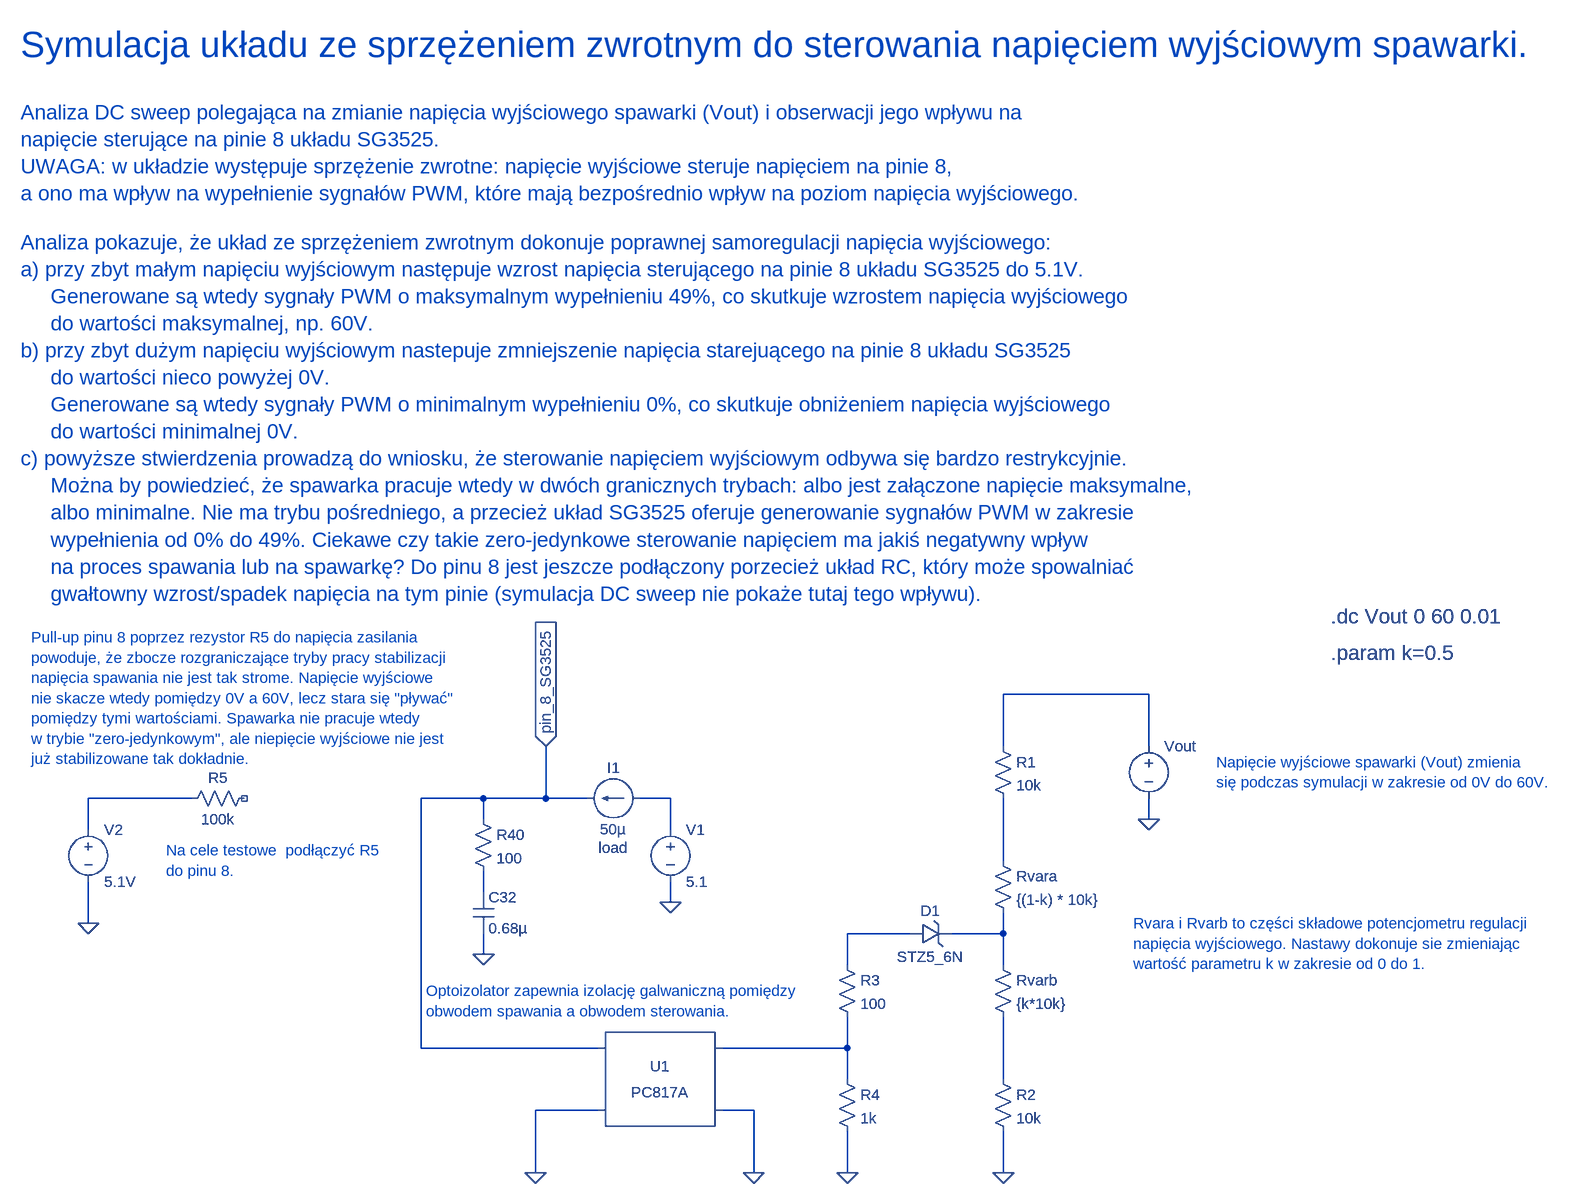
[diagram p0: schematic pin8_loopback_sim.asc]
pin8_loopback_sim.asc, the LTspice schematic file:
Version 4
SHEET 1 1872 756
WIRE 480 0 256 0
WIRE 256 80 256 0
WIRE 480 80 480 0
WIRE -992 160 -1152 160
WIRE -544 160 -640 160
WIRE -448 160 -448 80
WIRE -448 160 -544 160
WIRE -384 160 -448 160
WIRE -256 160 -304 160
WIRE -544 192 -544 160
WIRE 480 192 480 160
WIRE -1152 208 -1152 160
WIRE -256 208 -256 160
WIRE 256 256 256 160
WIRE -544 304 -544 272
WIRE -256 320 -256 288
WIRE -1152 352 -1152 288
WIRE 112 368 16 368
WIRE 256 368 256 336
WIRE 256 368 176 368
WIRE -544 400 -544 368
WIRE 16 416 16 368
WIRE 256 416 256 368
WIRE -640 544 -640 160
WIRE -368 544 -640 544
WIRE 16 544 16 496
WIRE 16 544 -176 544
WIRE 16 592 16 544
WIRE 256 592 256 496
WIRE -368 640 -464 640
WIRE -128 640 -176 640
WIRE -464 736 -464 640
WIRE -128 736 -128 640
WIRE 16 736 16 672
WIRE 256 736 256 672
FLAG 256 736 0
FLAG 480 192 0
FLAG 16 736 0
FLAG -128 736 0
FLAG -464 736 0
FLAG -256 320 0
FLAG -544 400 0
FLAG -448 80 pin_8_SG3525
IOPIN -448 80 In
FLAG -1152 352 0
SYMBOL res 240 64 R0
SYMATTR InstName R1
SYMATTR Value 10k
SYMBOL res 240 240 R0
SYMATTR InstName Rvara
SYMATTR Value {(1-k) * 10k}
SYMBOL res 240 400 R0
SYMATTR InstName Rvarb
SYMATTR Value {k*10k}
SYMBOL res 240 576 R0
SYMATTR InstName R2
SYMATTR Value 10k
SYMBOL voltage 480 64 R0
WINDOW 123 0 0 Left 0
WINDOW 39 0 0 Left 0
SYMATTR InstName Vout
SYMATTR Value ""
SYMBOL res 0 576 R0
SYMATTR InstName R4
SYMATTR Value 1k
SYMBOL res 0 400 R0
SYMATTR InstName R3
SYMATTR Value 100
SYMBOL zener 112 384 R270
WINDOW 0 36 32 VTop 2
WINDOW 3 -4 32 VBottom 2
SYMATTR InstName D1
SYMATTR Value STZ5_6N
SYMBOL Optos\\PC817A -272 592 M0
SYMATTR InstName U1
SYMBOL voltage -256 192 R0
WINDOW 123 0 0 Left 0
WINDOW 39 0 0 Left 0
SYMATTR InstName V1
SYMATTR Value 5.1
SYMBOL current -304 160 R90
WINDOW 0 -32 40 VBottom 2
WINDOW 3 32 40 VTop 2
WINDOW 123 0 0 Left 0
WINDOW 39 60 40 VTop 2
SYMATTR InstName I1
SYMATTR Value 50µ
SYMATTR SpiceLine load
SYMBOL res -560 176 R0
SYMATTR InstName R40
SYMATTR Value 100
SYMBOL cap -560 304 R0
SYMATTR InstName C32
SYMATTR Value 0.68µ
SYMBOL res -896 144 R90
WINDOW 0 0 56 VBottom 2
WINDOW 3 32 56 VTop 2
SYMATTR InstName R5
SYMATTR Value 100k
SYMBOL voltage -1152 192 R0
WINDOW 123 0 0 Left 0
WINDOW 39 0 0 Left 0
SYMATTR InstName V2
SYMATTR Value 5.1V
TEXT 760 -120 Left 3 !.dc Vout 0 60 0.01
TEXT -1256 -1000 Left 5 ;Symulacja układu ze sprzężeniem zwrotnym do sterowania napięciem wyjściowym spawarki.
TEXT -1256 -896 Left 3 ;Analiza DC sweep polegająca na zmianie napięcia wyjściowego spawarki (Vout) i obserwacji jego wpływu na\nnapięcie sterujące na pinie 8 układu SG3525.\nUWAGA: w układzie występuje sprzężenie zwrotne: napięcie wyjściowe steruje napięciem na pinie 8,\na ono ma wpływ na wypełnienie sygnałów PWM, które mają bezpośrednio wpływ na poziom napięcia wyjściowego.
TEXT 584 104 Left 2 ;Napięcie wyjściowe spawarki (Vout) zmienia\nsię podczas symulacji w zakresie od 0V do 60V.
TEXT 760 -64 Left 3 !.param k=0.5
TEXT 456 352 Left 2 ;Rvara i Rvarb to części składowe potencjometru regulacji \nnapięcia wyjściowego. Nastawy dokonuje sie zmieniając \nwartość parametru k w zakresie od 0 do 1.
TEXT -1256 -696 Left 3 ;Analiza pokazuje, że układ ze sprzężeniem zwrotnym dokonuje poprawnej samoregulacji napięcia wyjściowego:\na) przy zbyt małym napięciu wyjściowym następuje wzrost napięcia sterującego na pinie 8 układu SG3525 do 5.1V.\n     Generowane są wtedy sygnały PWM o maksymalnym wypełnieniu 49%, co skutkuje wzrostem napięcia wyjściowego\n     do wartości maksymalnej, np. 60V.\nb) przy zbyt dużym napięciu wyjściowym nastepuje zmniejszenie napięcia starejuącego na pinie 8 układu SG3525\n     do wartości nieco powyżej 0V.\n     Generowane są wtedy sygnały PWM o minimalnym wypełnieniu 0%, co skutkuje obniżeniem napięcia wyjściowego\n     do wartości minimalnej 0V.\nc) powyższe stwierdzenia prowadzą do wniosku, że sterowanie napięciem wyjściowym odbywa się bardzo restrykcyjnie.\n     Można by powiedzieć, że spawarka pracuje wtedy w dwóch granicznych trybach: albo jest załączone napięcie maksymalne,\n     albo minimalne. Nie ma trybu pośredniego, a przecież układ SG3525 oferuje generowanie sygnałów PWM w zakresie\n     wypełnienia od 0% do 49%. Ciekawe czy takie zero-jedynkowe sterowanie napięciem ma jakiś negatywny wpływ\n     na proces spawania lub na spawarkę? Do pinu 8 jest jeszcze podłączony porzecież układ RC, który może spowalniać\n     gwałtowny wzrost/spadek napięcia na tym pinie (symulacja DC sweep nie pokaże tutaj tego wpływu).
TEXT -632 456 Left 2 ;Optoizolator zapewnia izolację galwaniczną pomiędzy\nobwodem spawania a obwodem sterowania.
TEXT -1240 -88 Left 2 ;Pull-up pinu 8 poprzez rezystor R5 do napięcia zasilania\npowoduje, że zbocze rozgraniczające tryby pracy stabilizacji\nnapięcia spawania nie jest tak strome. Napięcie wyjściowe\nnie skacze wtedy pomiędzy 0V a 60V, lecz stara się "pływać"\npomiędzy tymi wartościami. Spawarka nie pracuje wtedy\nw trybie "zero-jedynkowym", ale niepięcie wyjściowe nie jest\njuż stabilizowane tak dokładnie.
TEXT -1032 240 Left 2 ;Na cele testowe  podłączyć R5\ndo pinu 8.

The netlist it stands for:
* pin8_loopback_sim.asc
R1 N001 N004 10k
Rvara N004 N007 {(1-k) * 10k}
Rvarb N007 N009 {k*10k}
R2 N009 0 10k
Vout N001 0
R4 N008 0 1k
R3 N006 N008 100
D1 N006 N007 STZ5_6N
XU1 N008 0 pin_8_SG3525 0 PC817 Igain=1m
V1 N003 0 5.1
I1 N003 pin_8_SG3525 50µ load
R40 pin_8_SG3525 N005 100
C32 N005 0 0.68µ
R5 NC_01 N002 100k
V2 N002 0 5.1V
.model D D
.lib standard.dio
.dc Vout 0 60 0.01
* Symulacja układu ze sprzężeniem zwrotnym do sterowania napięciem wyjściowym spawarki.
* Analiza DC sweep polegająca na zmianie napięcia wyjściowego spawarki (Vout) i obserwacji jego wpływu na
* napięcie sterujące na pinie 8 układu SG3525.
* UWAGA: w układzie występuje sprzężenie zwrotne: napięcie wyjściowe steruje napięciem na pinie 8,
* a ono ma wpływ na wypełnienie sygnałów PWM, które mają bezpośrednio wpływ na poziom napięcia wyjściowego.
* Napięcie wyjściowe spawarki (Vout) zmienia
* się podczas symulacji w zakresie od 0V do 60V.
.param k=0.5
* Rvara i Rvarb to części składowe potencjometru regulacji
* napięcia wyjściowego. Nastawy dokonuje sie zmieniając
* wartość parametru k w zakresie od 0 do 1.
* Analiza pokazuje, że układ ze sprzężeniem zwrotnym dokonuje poprawnej samoregulacji napięcia wyjściowego:
* a) przy zbyt małym napięciu wyjściowym następuje wzrost napięcia sterującego na pinie 8 układu SG3525 do 5.1V.
*      Generowane są wtedy sygnały PWM o maksymalnym wypełnieniu 49%, co skutkuje wzrostem napięcia wyjściowego
*      do wartości maksymalnej, np. 60V.
* b) przy zbyt dużym napięciu wyjściowym nastepuje zmniejszenie napięcia starejuącego na pinie 8 układu SG3525
*      do wartości nieco powyżej 0V.
*      Generowane są wtedy sygnały PWM o minimalnym wypełnieniu 0%, co skutkuje obniżeniem napięcia wyjściowego
*      do wartości minimalnej 0V.
* c) powyższe stwierdzenia prowadzą do wniosku, że sterowanie napięciem wyjściowym odbywa się bardzo restrykcyjnie.
*      Można by powiedzieć, że spawarka pracuje wtedy w dwóch granicznych trybach: albo jest załączone napięcie maksymalne,
*      albo minimalne. Nie ma trybu pośredniego, a przecież układ SG3525 oferuje generowanie sygnałów PWM w zakresie
*      wypełnienia od 0% do 49%. Ciekawe czy takie zero-jedynkowe sterowanie napięciem ma jakiś negatywny wpływ
*      na proces spawania lub na spawarkę? Do pinu 8 jest jeszcze podłączony porzecież układ RC, który może spowalniać
*      gwałtowny wzrost/spadek napięcia na tym pinie (symulacja DC sweep nie pokaże tutaj tego wpływu).
* Optoizolator zapewnia izolację galwaniczną pomiędzy
* obwodem spawania a obwodem sterowania.
* Pull-up pinu 8 poprzez rezystor R5 do napięcia zasilania
* powoduje, że zbocze rozgraniczające tryby pracy stabilizacji
* napięcia spawania nie jest tak strome. Napięcie wyjściowe
* nie skacze wtedy pomiędzy 0V a 60V, lecz stara się "pływać"
* pomiędzy tymi wartościami. Spawarka nie pracuje wtedy
* w trybie "zero-jedynkowym", ale niepięcie wyjściowe nie jest
* już stabilizowane tak dokładnie.
* Na cele testowe  podłączyć R5
* do pinu 8.
.lib PC817.sub
.backanno
.end